# Altium schematic sheet FanControl.SchDoc
size A; SheetNumber: 3; SheetTotal: 7
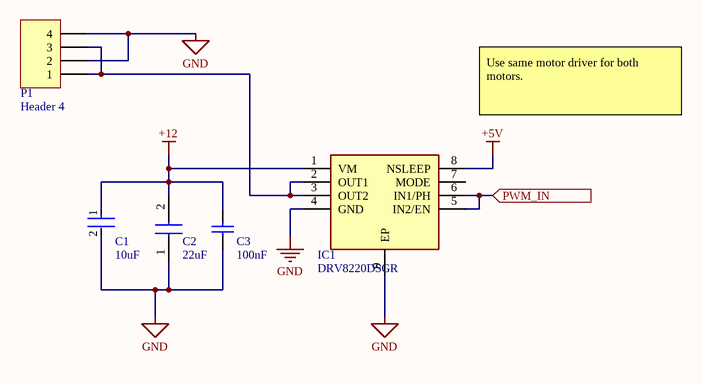
[diagram p0: FanControl.SchDoc]

## Parts
C1  Capacitance: 10uF  [FP-CL05A106MP5NUNC-MFG]  (hidden comment: CL05A106MP5NUNC)
C2  value 22uF  [CAPC1608X105N]  (hidden comment: CL10A226MP8NUNE)
C3  Capacitance: 100nF  [CAPC1050X55X23ML05T13]  (hidden comment: CL05B104KO5NNNC)
IC1  DRV8220DSGR  [SON50P200X200X80-9N]
P1  Header 4  [HDR1X4]

## Ports
PWM_IN (in, see Main[1B])

## Nets
+5V: IC1.8(NSLEEP)
+12: C1.1 C2.2 C3.2 IC1.1(VM)
GND: C1.2 C2.1 C3.1 IC1.4(GND) IC1.9(EP) P1.2 P1.4
PWM_IN: IC1.5(IN2/EN) IC1.6(IN1/PH) ; port PWM_IN
NetIC1_2: IC1.2(OUT1) IC1.3(OUT2) P1.1 P1.3

Not connected (* = marked no-connect by the designer): IC1 7(MODE)

## Notes on the sheet
- Use same motor driver for both motors.

## Library data of the parts
C1 = CMP-13271-000002-1: CAP CER 10UF 10V X5R 0402; Manufacturer: Samsung; Temperature Coefficient: 15%; Tolerance: 20%; Material: Ceramic; Octopart: https://octopart.com/cl05a106mp5nunc-samsung-22457395; Voltage Rating: 10V; RoHS: TRUE; Value: 10uF; Height: 0.7mm; Digikey Description: CAP CER 10UF 10V X5R 0402; Automotive: No; Package: CL05A106MP5NUNC; Device Class L1: Passive Components; Temperature Range High: +85°C; ComponentLink2Description: Datasheet; Device Class L2: Capacitors; Temperature Characteristic: X5R; Manufacturer Part Number: CL05A106MP5NUNC; Temperature: -55°C to +85°C; ComponentLink2URL: http://www.samsungsem.com/kr/support/product-search/mlcc/__icsFiles/afieldfile/2019/05/10/19-CL05A106MP5NUNC.pdf; Device Class L3: Ceramic Capacitors; Category: Cap; Temperature Range Low: -55°C; Ipc Land Pattern Name: CAPC10050X50; Lead Free: Yes
C2 = CL10A226MP8NUNE: Capacitor; Manufacturer_Name: SAMSUNG; Datasheet Link: https://datasheet.datasheetarchive.com/originals/distributors/Datasheets-DGA10/2407063.pdf; Height: 1.05mm; Manufacturer_Part_Number: CL10A226MP8NUNE; Mouser Part Number: 187-CL10A226MP8NUNE; Mouser Price/Stock: https://www.mouser.co.uk/ProductDetail/Samsung-Electro-Mechanics/CL10A226MP8NUNE?qs=gRKWieUq2Hb5O0PTfRKzDQ%3D%3D; Arrow Part Number: CL10A226MP8NUNE; Arrow Price/Stock: https://www.arrow.com/en/products/cl10a226mp8nune/samsung-electro-mechanics?region=nac
C3 = CMP-2000-05439-1: Chip Capacitor, 100 nF, +/- 10%, 16 V, -55 to 125 degC, 0402 (1005 Metric), RoHS, Tape and Reel; Manufacturer: Samsung Electro-Mechanics; Dielectric: X7R; Rated Voltage: 16V; Case Size/Dimension: 0402; Tolerance (%): ±10%; Manufacturer URL: http://www.samsungsem.com/global/index.jsp; Datasheet URL: https://datasheet.ciiva.com/29198/458718-da-01-en-vs-kondensator-0402-29198423.pdf; Datasheet Version: Nov-10
IC1 = DRV8220DSGR: Integrated Circuit; Manufacturer_Name: Texas Instruments; Datasheet Link: https://www.ti.com/lit/gpn/drv8220; Height: 0.8mm; Manufacturer_Part_Number: DRV8220DSGR; Mouser Part Number: 595-DRV8220DSGR; Mouser Price/Stock: https://www.mouser.co.uk/ProductDetail/Texas-Instruments/DRV8220DSGR?qs=A6eO%252BMLsxmR1BpX9iMystg%3D%3D; Arrow Part Number: DRV8220DSGR; Arrow Price/Stock: https://www.arrow.com/en/products/drv8220dsgr/texas-instruments?region=nac
P1 = Header 4: Header, 4-Pin; LatestRevisionDate: 17-Jul-2002; LatestRevisionNote: Re-released for DXP Platform.; Publisher: Altium Limited